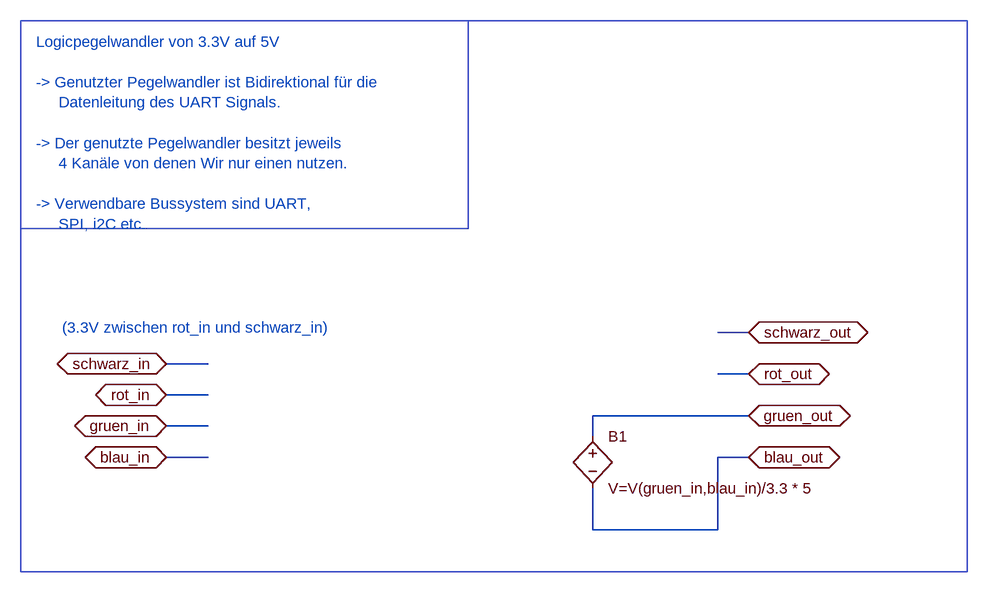
[diagram p0: schematic LogikLevelshifter.asc]
LogikLevelshifter.asc, the LTspice schematic file:
Version 4
SHEET 1 1276 680
WIRE 400 -176 352 -176
WIRE -432 -128 -496 -128
WIRE 400 -112 352 -112
WIRE -432 -80 -496 -80
WIRE 400 -48 160 -48
WIRE -432 -32 -496 -32
WIRE 160 -16 160 -48
WIRE -432 16 -496 16
WIRE 400 16 352 16
WIRE 160 128 160 64
WIRE 352 128 352 16
WIRE 352 128 160 128
FLAG -496 -128 schwarz_in
IOPIN -496 -128 BiDir
FLAG -496 -80 rot_in
IOPIN -496 -80 BiDir
FLAG -496 -32 gruen_in
IOPIN -496 -32 BiDir
FLAG -496 16 blau_in
IOPIN -496 16 BiDir
FLAG 400 -176 schwarz_out
IOPIN 400 -176 BiDir
FLAG 400 -48 gruen_out
IOPIN 400 -48 BiDir
FLAG 400 16 blau_out
IOPIN 400 16 BiDir
FLAG 400 -112 rot_out
IOPIN 400 -112 BiDir
SYMBOL bv 160 -32 R0
SYMATTR InstName B1
SYMATTR Value V=V(gruen_in,blau_in)/3.3 * 5
TEXT -656 -184 Left 2 ;(3.3V zwischen rot_in und schwarz_in)
TEXT -696 -624 Left 2 ;Logicpegelwandler von 3.3V auf 5V\n \n-> Genutzter Pegelwandler ist Bidirektional für die \n     Datenleitung des UART Signals.\n \n-> Der genutzte Pegelwandler besitzt jeweils\n     4 Kanäle von denen Wir nur einen nutzen.\n \n-> Verwendbare Bussystem sind UART,\n     SPI, i2C etc.
RECTANGLE Normal -32 -336 -720 -656
RECTANGLE Normal 736 192 -720 -656

The netlist it stands for:
* LogikLevelshifter.asc
B1 gruen_out blau_out V=V(gruen_in,blau_in)/3.3 * 5
* (3.3V zwischen rot_in und schwarz_in)
* Logicpegelwandler von 3.3V auf 5V
* -> Genutzter Pegelwandler ist Bidirektional für die
*      Datenleitung des UART Signals.
* -> Der genutzte Pegelwandler besitzt jeweils
*      4 Kanäle von denen Wir nur einen nutzen.
* -> Verwendbare Bussystem sind UART,
*      SPI, i2C etc.
.backanno
.end